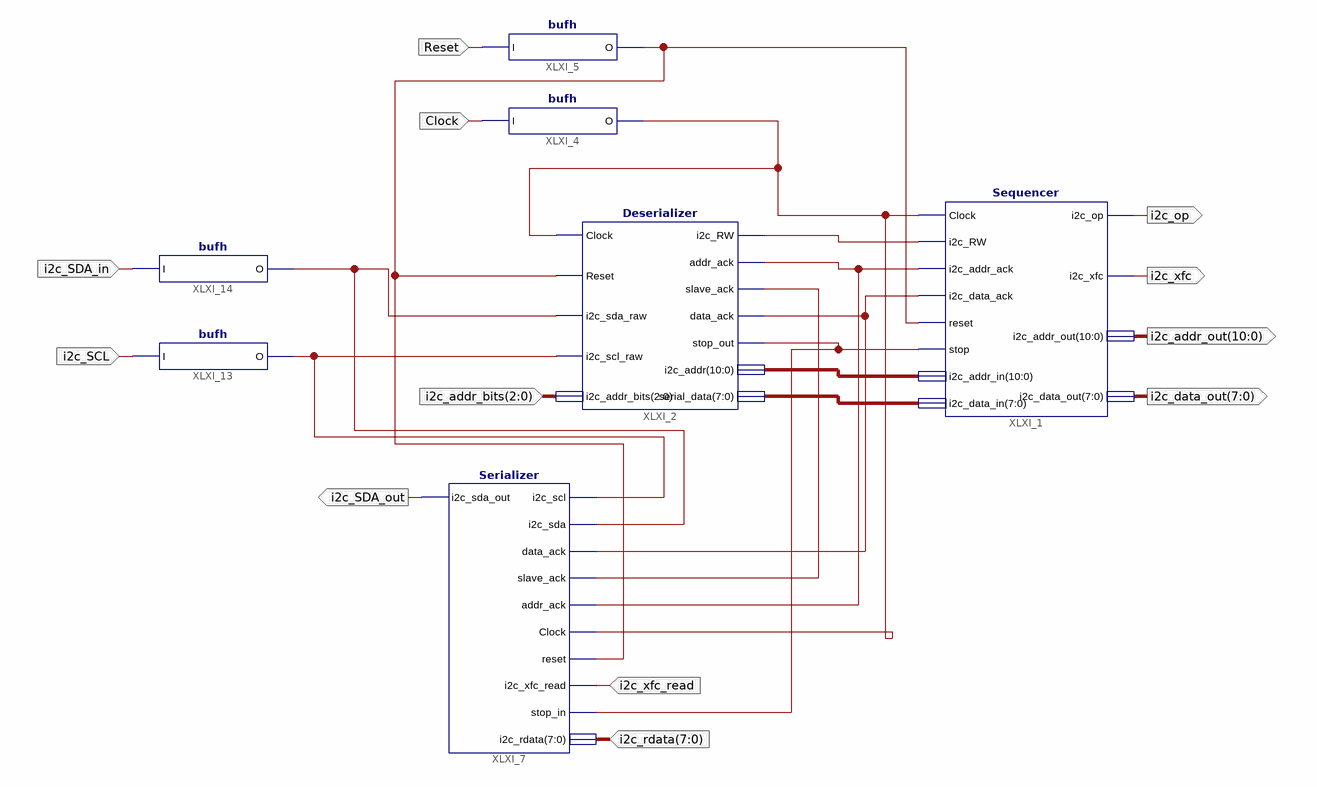
[diagram p0: schematic sheet 1]
// Xilinx ISE schematic i2c_Top_Block.sch (artix7) as structural Verilog: 7 symbols, 12 ports
module i2c_Top_Block (
  input  [2:0] i2c_addr_bits,
  input  Clock,
  input  Reset,
  input  i2c_SCL,
  input  [7:0] i2c_rdata,
  input  i2c_xfc_read,
  input  i2c_SDA_in,
  output i2c_op,
  output i2c_xfc,
  output [10:0] i2c_addr_out,
  output [7:0] i2c_data_out,
  output i2c_SDA_out
);

  wire XLXN_1, XLXN_2, XLXN_3, XLXN_24, XLXN_27, XLXN_28, XLXN_63, XLXN_67, XLXN_68;
  wire [7:0] XLXN_6;
  wire [10:0] XLXN_5;

  Sequencer XLXI_1 (
    .Clock(XLXN_63), .i2c_RW(XLXN_1), .i2c_addr_ack(XLXN_2), .i2c_data_ack(XLXN_3), .reset(XLXN_24),
    .stop(XLXN_27), .i2c_addr_in(XLXN_5), .i2c_data_in(XLXN_6), .i2c_op(i2c_op), .i2c_xfc(i2c_xfc),
    .i2c_addr_out(i2c_addr_out), .i2c_data_out(i2c_data_out));
  Deserializer XLXI_2 (
    .Clock(XLXN_63), .Reset(XLXN_24), .i2c_sda_raw(XLXN_68), .i2c_scl_raw(XLXN_67),
    .i2c_addr_bits(i2c_addr_bits), .i2c_RW(XLXN_1), .addr_ack(XLXN_2), .slave_ack(XLXN_28),
    .data_ack(XLXN_3), .stop_out(XLXN_27), .i2c_addr(XLXN_5), .serial_data(XLXN_6));
  bufh XLXI_4 (.I(Clock), .O(XLXN_63));
  bufh XLXI_5 (.I(Reset), .O(XLXN_24));
  Serializer XLXI_7 (
    .i2c_scl(XLXN_67), .i2c_sda(XLXN_68), .data_ack(XLXN_3), .slave_ack(XLXN_28), .addr_ack(XLXN_2),
    .Clock(XLXN_63), .reset(XLXN_24), .i2c_xfc_read(i2c_xfc_read), .stop_in(XLXN_27), .i2c_rdata(i2c_rdata),
    .i2c_sda_out(i2c_SDA_out));
  bufh XLXI_13 (.I(i2c_SCL), .O(XLXN_67));
  bufh XLXI_14 (.I(i2c_SDA_in), .O(XLXN_68));
endmodule
